# Altium project Quadcopter.PrjPcb
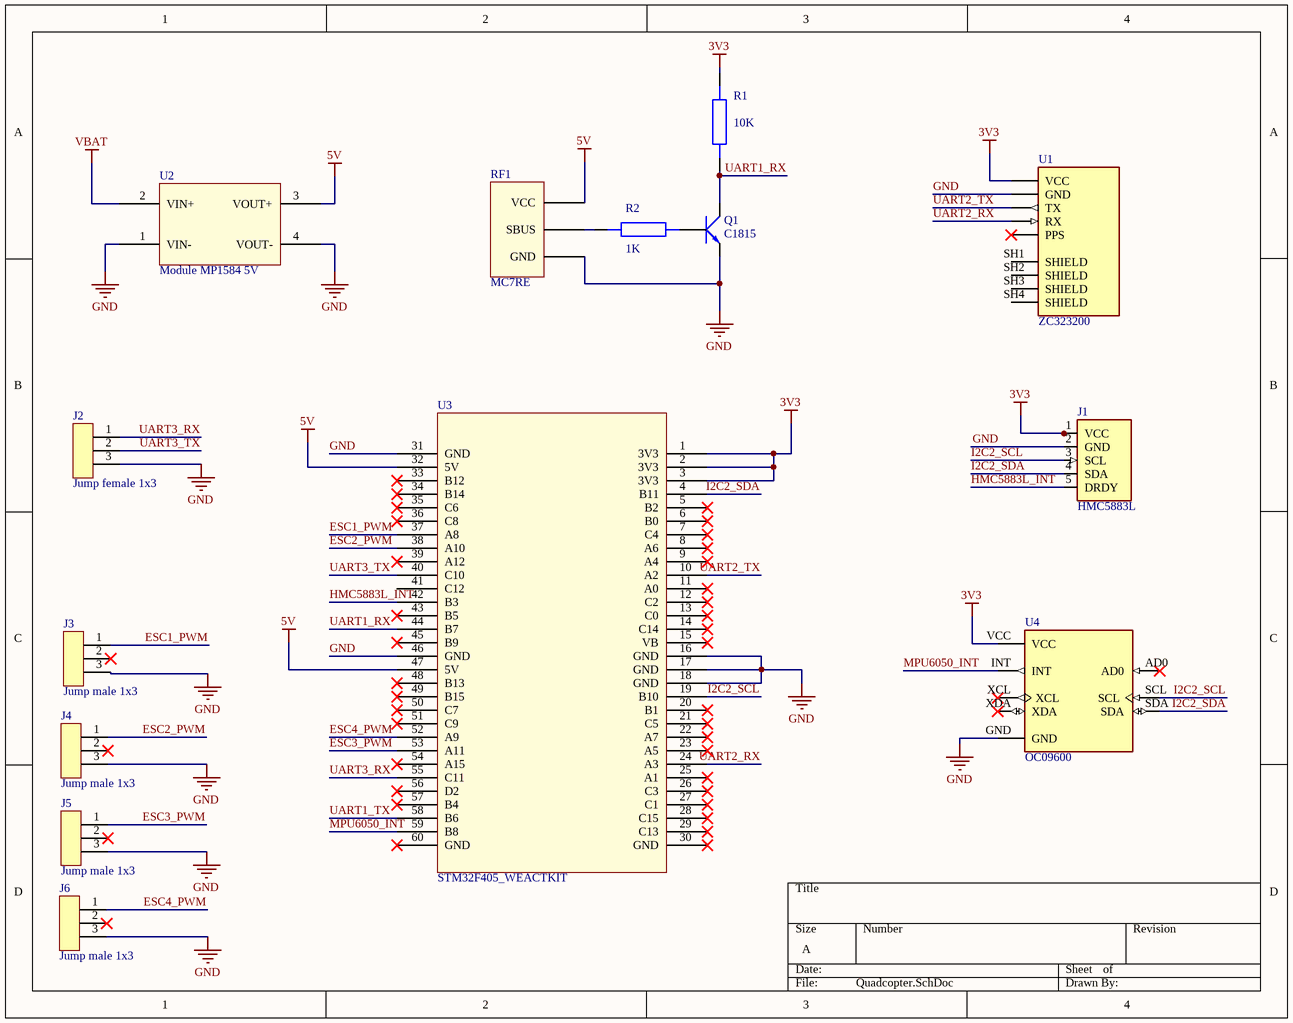
[diagram p0: Quadcopter.SchDoc]
1 sheet, 14 parts. Net scope: global (net labels, ports and power ports of the same name join across sheets).

## Sheet Quadcopter.SchDoc
size A; SheetNumber: 1; SheetTotal: 1

### Parts
J1  HMC5883L  [HMC5883L]
J2  Jump female 1x3  [FEMALE JUMP 1X3]
J3  Jump male 1x3  [FEMALE JUMP 1X3]
J4  Jump male 1x3  [FEMALE JUMP 1X3]
J5  Jump male 1x3  [FEMALE JUMP 1X3]
J6  Jump male 1x3  [FEMALE JUMP 1X3]
Q1  C1815  [TO92127P508H508-3]
R1  10K  [Tro Vach 1/4W]
R2  1K  [Tro Vach 1/4W]
RF1  MC7RE  [RECEIVER]
U1  ZC323200  [GPS_NEO]
U2  Module MP1584 5V  [MODULE_MP1584]
U3  STM32F405_WEACTKIT  [STM32F405RGT6 - WEACT kit]
U4  OC09600  [MODULE_MPU6050]

### Nets
3V3: J1.1(VCC) R1.2 U1.5(VCC) U3.1(3V3) U3.2(3V3) U3.3(3V3) U4.VCC
5V: RF1.5V(VCC) U2.3(VOUT+) U3.32(5V) U3.47(5V)
GND: J1.2(GND) J2.3 J3.3 J4.3 J5.3 J6.3 Q1.1(E) RF1.GND U1.4(GND) U2.1(VIN-) U2.4(VOUT-) U3.16(GND) U3.17(GND) U3.18(GND) U3.31(GND) U3.46(GND) U4.GND
VBAT: U2.2(VIN+)
ESC1_PWM: J3.1 U3.37(A8)
ESC2_PWM: J4.1 U3.38(A10)
ESC3_PWM: J5.1 U3.53(A11)
ESC4_PWM: J6.1 U3.52(A9)
HMC5883L_INT: J1.5(DRDY) U3.42(B3)
I2C2_SCL: J1.3(SCL) U3.19(B10) U4.SCL
I2C2_SDA: J1.4(SDA) U3.4(B11) U4.SDA
MPU6050_INT: U3.59(B8) U4.INT
UART1_RX: Q1.2(C) R1.1 U3.44(B7)
UART1_TX: U3.58(B6)
UART2_RX: U1.2(RX) U3.24(A3)
UART2_TX: U1.3(TX) U3.10(A2)
UART3_RX: J2.1 U3.55(C11)
UART3_TX: J2.2 U3.40(C10)
NetQ1_3: Q1.3(B) R2.2
NetR2_1: R2.1 RF1.SBUS

Not connected (* = marked no-connect by the designer): J3 2*; J4 2*; J5 2*; J6 2*; U1 1(PPS)* SH1(SHIELD) SH2(SHIELD) SH3(SHIELD) SH4(SHIELD); U3 5(B2)* 6(B0)* 7(C4)* 8(A6)* 9(A4)* 11(A0)* 12(C2)* 13(C0)* 14(C14)* 15(VB)* 20(B1)* 21(C5)* 22(A7)* 23(A5)* 25(A1)* 26(C3)* 27(C1)* 28(C15)* 29(C13)* 30(GND)* 33(B12)* 34(B14)* 35(C6)* 36(C8)* 39(A12)* 41(C12) 43(B5)* 45(B9)* 48(B13)* 49(B15)* 50(C7)* 51(C9)* 54(A15)* 56(D2)* 57(B4)* 60(GND)*; U4 AD0* XCL* XDA*

### Library data of the parts
J1 = HMC5883L: Magnetic Sensor Development Tools 3-Axis Digital Compass w 12-Bit ADC; MF: STMicroelectronics; SnapEDA_Link: https://www.snapeda.com/parts/HMC5883L/STMicroelectronics/view-part/?ref=snap; Package: None; Value: *; MP: HMC5883L; Check_prices: https://www.snapeda.com/parts/HMC5883L/STMicroelectronics/view-part/?ref=eda
Q1 = Trans C1815 DIP: NPN transistor; Value: C9014
R1 R2 = RES
RF1 = RECEIVER
U1 = ZC323200: GY-NEO6MV2 GY-GPS6MV2 NEO-6M GPS Module with Flight Control APM2.5; MF: YKS; SnapEDA_Link: https://www.snapeda.com/parts/ZC323200/YKS/view-part/?ref=snap; Package: None; Value: *; MP: ZC323200; Check_prices: https://www.snapeda.com/parts/ZC323200/YKS/view-part/?ref=eda
U4 = OC09600: GY-521 6 DOF MPU-6050 Module 3 Axis Accelerometer Gyroscope Module for Arduino; MF: YKS; SnapEDA_Link: https://www.snapeda.com/parts/OC09600/YKS/view-part/?ref=snap; Package: None; Value: *; MP: OC09600; Check_prices: https://www.snapeda.com/parts/OC09600/YKS/view-part/?ref=eda